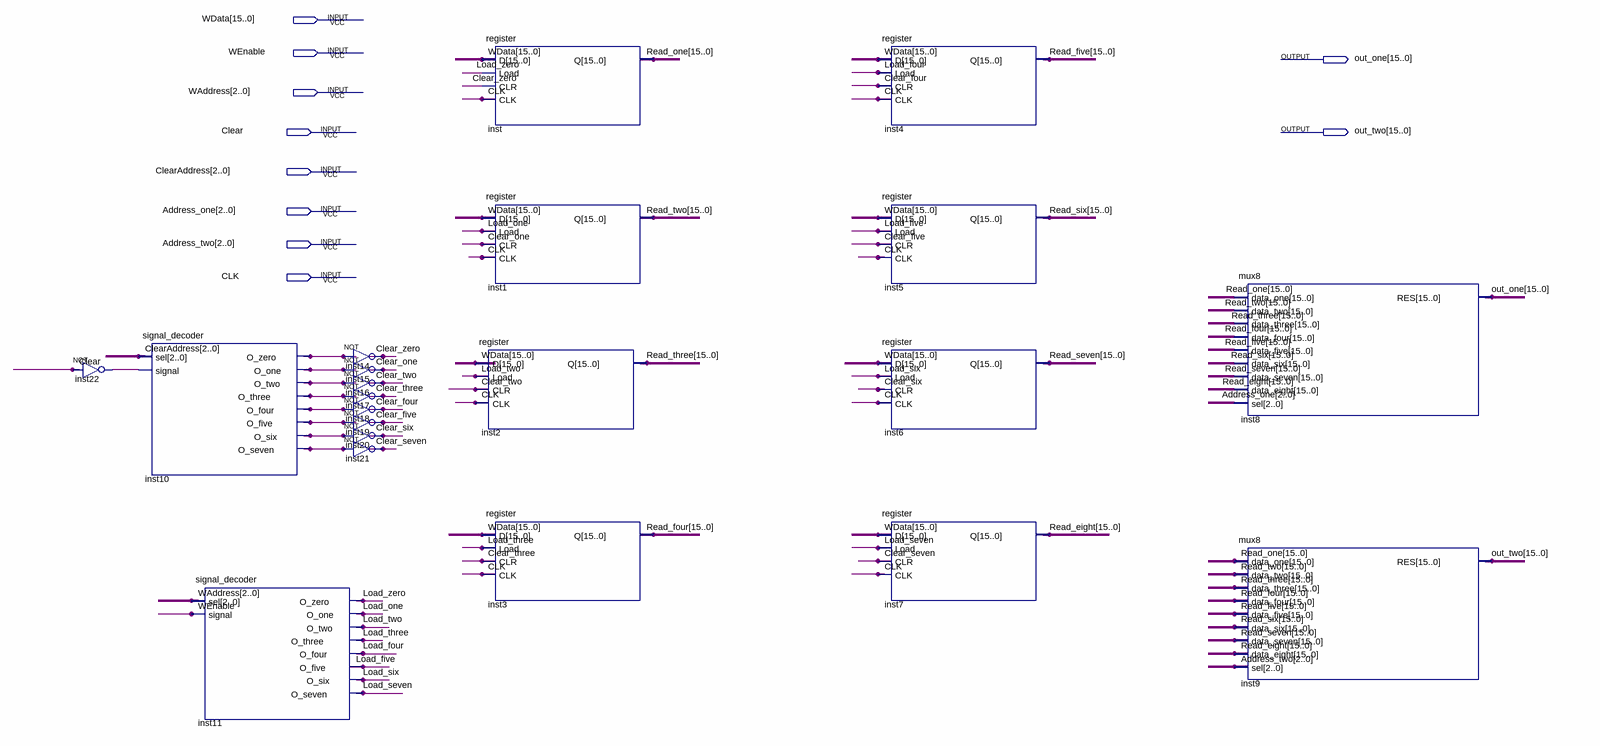
[diagram p0: schematic sheet]
// Quartus schematic bank_register.bdf as structural Verilog: 21 symbols, 10 pins
module bank_register (
  input  [15:0] WData,
  input  WEnable,
  input  [2:0] WAddress,
  input  Clear,
  input  [2:0] ClearAddress,
  input  [2:0] Address_one,
  input  [2:0] Address_two,
  input  CLK,
  output [15:0] out_one,
  output [15:0] out_two
);

  wire Clear_five, Clear_four, Clear_one, Clear_seven, Clear_six, Clear_three, Clear_two, Clear_zero,
       inst10_o_five, inst10_o_four, inst10_o_one, inst10_o_seven, inst10_o_six, inst10_o_three,
       inst10_o_two, inst10_o_zero, inst22_out, Load_five, Load_four, Load_one, Load_seven, Load_six,
       Load_three, Load_two, Load_zero;
  wire [15:0] Read_eight, Read_five, Read_four, Read_one, Read_seven, Read_six, Read_three, Read_two;

  not inst22 (inst22_out, Clear);
  signal_decoder inst10 (
    .sel(ClearAddress), .signal(inst22_out), .O_zero(inst10_o_zero), .O_one(inst10_o_one),
    .O_two(inst10_o_two), .O_three(inst10_o_three), .O_four(inst10_o_four), .O_five(inst10_o_five),
    .O_six(inst10_o_six), .O_seven(inst10_o_seven));
  signal_decoder inst11 (
    .sel(WAddress), .signal(WEnable), .O_zero(Load_zero), .O_one(Load_one), .O_two(Load_two),
    .O_three(Load_three), .O_four(Load_four), .O_five(Load_five), .O_six(Load_six), .O_seven(Load_seven));
  not inst14 (Clear_zero, inst10_o_zero);
  not inst15 (Clear_one, inst10_o_one);
  not inst16 (Clear_two, inst10_o_two);
  not inst17 (Clear_three, inst10_o_three);
  not inst18 (Clear_four, inst10_o_four);
  not inst19 (Clear_five, inst10_o_five);
  not inst20 (Clear_six, inst10_o_six);
  not inst21 (Clear_seven, inst10_o_seven);
  register inst2 (.D(WData), .Load(Load_two), .CLR(Clear_two), .CLK(CLK), .Q(Read_three));
  register inst (.D(WData), .Load(Load_zero), .CLR(Clear_zero), .CLK(CLK), .Q(Read_one));
  register inst1 (.D(WData), .Load(Load_one), .CLR(Clear_one), .CLK(CLK), .Q(Read_two));
  register inst3 (.D(WData), .Load(Load_three), .CLR(Clear_three), .CLK(CLK), .Q(Read_four));
  register inst4 (.D(WData), .Load(Load_four), .CLR(Clear_four), .CLK(CLK), .Q(Read_five));
  register inst5 (.D(WData), .Load(Load_five), .CLR(Clear_five), .CLK(CLK), .Q(Read_six));
  register inst6 (.D(WData), .Load(Load_six), .CLR(Clear_six), .CLK(CLK), .Q(Read_seven));
  register inst7 (.D(WData), .Load(Load_seven), .CLR(Clear_seven), .CLK(CLK), .Q(Read_eight));
  mux8 inst8 (
    .data_one(Read_one), .data_two(Read_two), .data_three(Read_three), .data_four(Read_four),
    .data_five(Read_five), .data_six(Read_six), .data_seven(Read_seven), .data_eight(Read_eight),
    .sel(Address_one), .RES(out_one));
  mux8 inst9 (
    .data_one(Read_one), .data_two(Read_two), .data_three(Read_three), .data_four(Read_four),
    .data_five(Read_five), .data_six(Read_six), .data_seven(Read_seven), .data_eight(Read_eight),
    .sel(Address_two), .RES(out_two));
endmodule
